# EAGLE design LB_BIT_w9_PROTO-v03(3_3) (EAGLE 6.6.0)
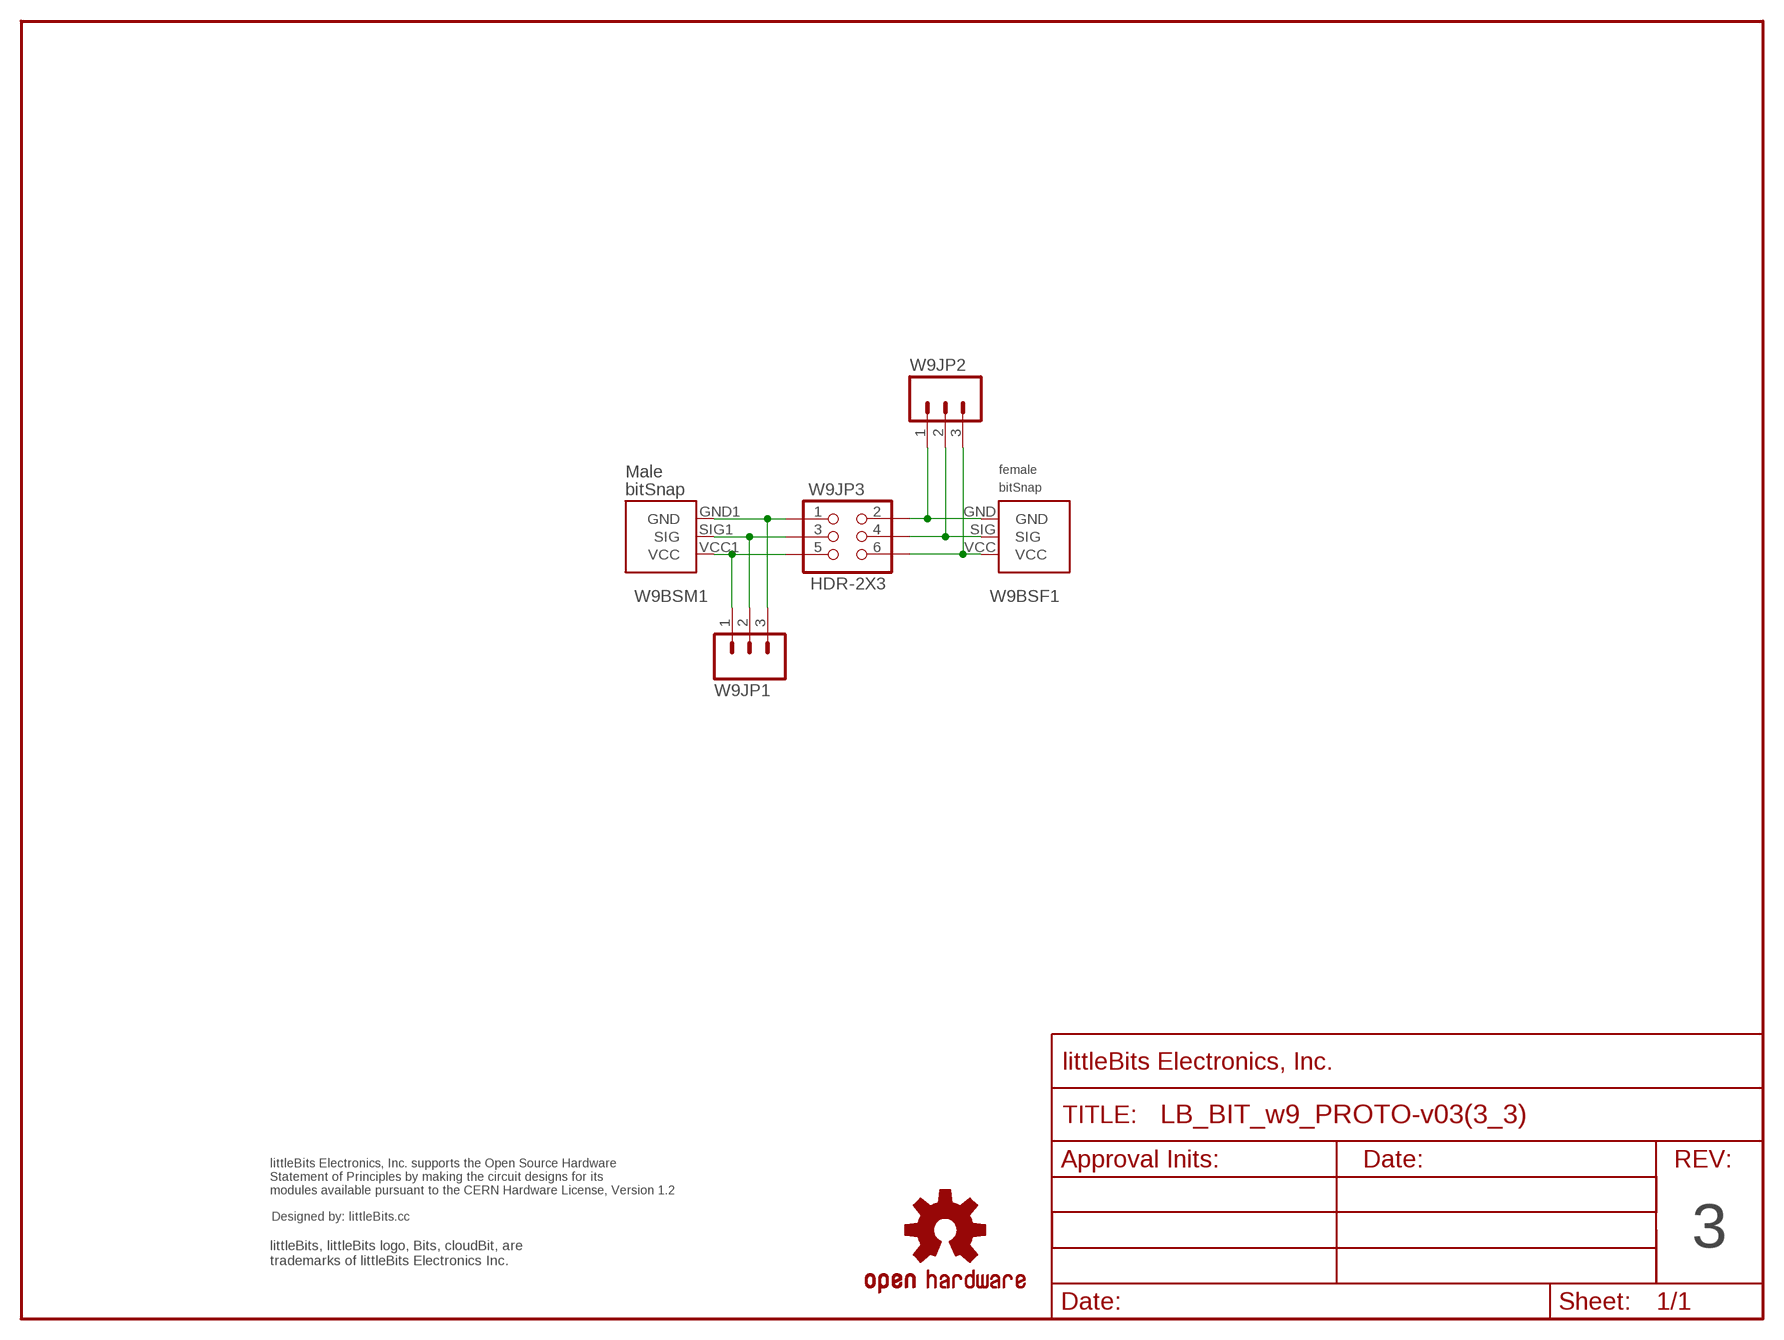
[diagram p0: schematic, sheet 1]

## Parts
U$5  OSHWCREDIT  [OSHWCREDIT]
U$11  OSHW-LOGOL  [OSHW-LOGO-L]
U$13  FRAME-LETTER-OHWOHW  [FABDWG01-OHW]
W9BSF1  BITSNAP_V03_FEMALE"  [BITSNAP_V03_FEMALE_NO_ARROW]
W9BSM1  BITSNAP_V03_MALE  [BITSNAP_V03_MALE]
W9JP1  SCREW-TERMINAL-3PIN-2.54MM  [22-23-2031]
W9JP2  SCREW-TERMINAL-3PIN-2.54MM  [22-23-2031]
W9JP3  HDR-2X3  [2X03]

## Nets
GND1: W9BSM1.GND1(GND) W9JP1.3 W9JP3.1
GND2: W9BSF1.GND W9JP2.1 W9JP3.2
N$1: W9BSM1.SIG1(SIG) W9JP1.2 W9JP3.3
N$2: W9BSM1.VCC1(VCC) W9JP1.1 W9JP3.5
N$3: W9BSF1.VCC W9JP2.3 W9JP3.6
N$4: W9BSF1.SIG W9JP2.2 W9JP3.4

## Notes on the sheet
- 3

## Library data of the parts
U$5 = LITTLEBITS:OSHWCREDIT
U$11 = LITTLEBITS:OSHW-LOGO: Open Source Hardware Logo This logo indicates the piece of hardware it is found on incorporates a OSHW license and/or adheres to the definition of open source hardware found here: http://freedomdefined.org/OSHW
U$13 = LITTLEBITS:FRAME-LETTER-OHW
W9BSF1 = bitSnap:BITSNAP_V03_FEMALE
W9BSM1 = bitSnap:BITSNAP_V03_MALE
W9JP1 W9JP2 = LITTLEBITS:SCREW-TERMINAL-3PIN-2.54MM
W9JP3 = LITTLEBITS:HDR-2X3

## Board
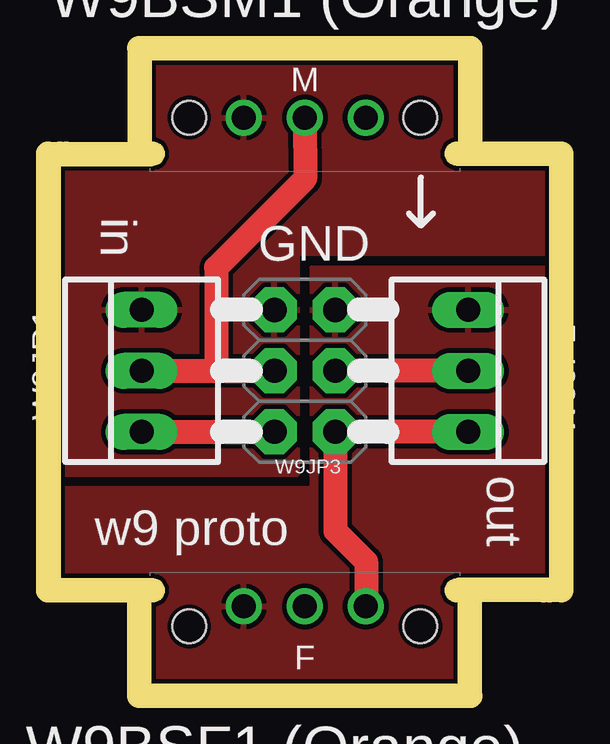
[diagram p1: board, top side]
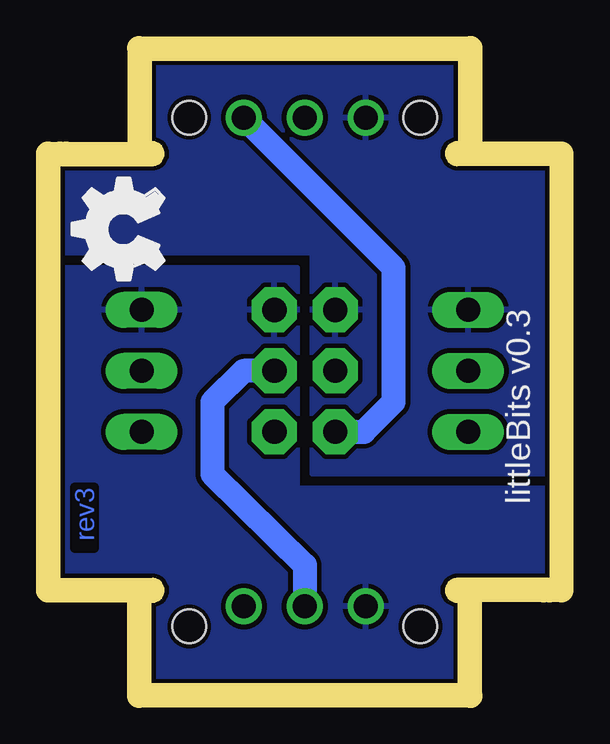
[diagram p2: board, bottom side, seen from below]

Size 20.4 x 26 mm. Coordinates in mm from the lower left corner, seen from the top.
Outline: 0,21.6 0,4.4
Outline: 20.4,4.4 20.4,21.6
Copper layers (1*16): Top 0.035mm / dielectric 1.5mm / Bottom 0.035mm
Design rules "littleBitsDRC": minimum track width 0.2mm, minimum drill 0.4mm, track to track 0.2mm, track to pad 0.2mm, pad to pad 0.2mm, via to via 0.2mm, smd to smd 0mil, copper to edge 0.2mm, drill to drill 0.2mm, minimum pad ring 0.2mm, minimum via ring 0.15mm, stop-mask expansion 0.1mm, vias tented up to drill 0mil, thermal gap 0.2mm
Milling: 6 lines

### Footprints (pad centres in the part's own frame; a part is rotated, then mirrored left to right if it is on the bottom)
BITSNAP_V03_FEMALE_NO_ARROW = drill 1: GND 4.065,3.44; SIG 6.605,3.44; VCC 9.145,3.44 | hole 1.4: 1.785,2.61; 11.425,2.61
BITSNAP_V03_MALE = drill 1: GND1 9.145,2.61; SIG1 6.605,2.61; VCC1 4.065,2.61 | hole 1.4: 1.785,2.61; 11.425,2.61
22-23-2031 = drill 1 long: 1 -2.54,0; 2 0,0; 3 2.54,0
2X03 = drill 1.016 pad 1.88 octagon: 1 0,5.08; 2 2.54,5.08; 3 0,2.54; 4 2.54,2.54; 5 0,0; 6 2.54,0

### Placement (x,y rotation side)
DRILEGEND  [DRILEGEND]  -10.92,-32.08 0 top  (outside the outline)
U$1  [OSHW_FILLX150_NOTEXT]  16.07,16 0 top
U$5  -90.76,-69.34 0 top  (outside the outline)
U$11  -29.93,-75.73 0 top  (outside the outline)
U$13  3.6,-6.82 0 top  (outside the outline)
W9BSF1  3.6,-0.21 0 top
W9BSM1  16.8,26.21 180 top
W9JP1  3.4,13.05 90 top
W9JP2  17,13.05 270 top
W9JP3  8.93,10.51 0 top

### Tracks (layer width: path | path; a pad name or v marks a point on that pad's centre or on a via)
GND1
  pour Bottom: 20.45,26.06 0.01,26.06 -0.05,8.75 9.9,8.75 9.9,17.95 20.35,17.95
  pour Top: 0.12,26.04 0.02,26.04 -0.05,8.75 9.9,8.75 9.9,17.95 20.35,17.95 20.47,26.04
GND2
  pour Bottom: 10.5,17.35 20.4,17.35 20.38,0.03 -0.04,0.01 0,8.16 10.5,8.15
  pour Top: 10.5,17.35 20.4,17.35 20.4,0.02 -0.04,0 0,8.16 10.5,8.15
N$1
  Top 1: W9JP1.2 6.35,13.05 | 6.35,13.05 W9JP3.3 | W9BSM1.SIG1 10.21,21.06 6.5,17.35 6.5,13.2 6.35,13.05
N$2
  Top 1: W9JP1.1 W9JP3.5
  Bottom 1: W9JP3.5 7.74,10.51 6.5,11.75 6.5,17.34 W9BSM1.VCC1
N$3
  Top 1: W9BSF1.VCC 12.75,3.34 12.75,5.1 11.47,6.38 W9JP3.6 W9JP2.3
N$4
  Top 1: W9JP2.2 W9JP3.4
  Bottom 1: W9JP3.4 12.75,13.05 14.05,11.75 14.05,8.75 10.2,4.95 W9BSF1.SIG

### Text on the board
Bottom: rev3
tPlace: in | GND | out | w9 proto
bPlace: littleBits v0.3
tNames: W9BSM1 (Orange) | W9BSF1 (Orange)
Milling: 1mm DIA. ROUTER PATH
dxf: 3 | w9-protoBit
DrillLegend: LAYER-STACK
DrillLegend_01-16: 01-16
DrillLegend_01-20: 01-20